# EAGLE design M302X (EAGLE 6.6.0)
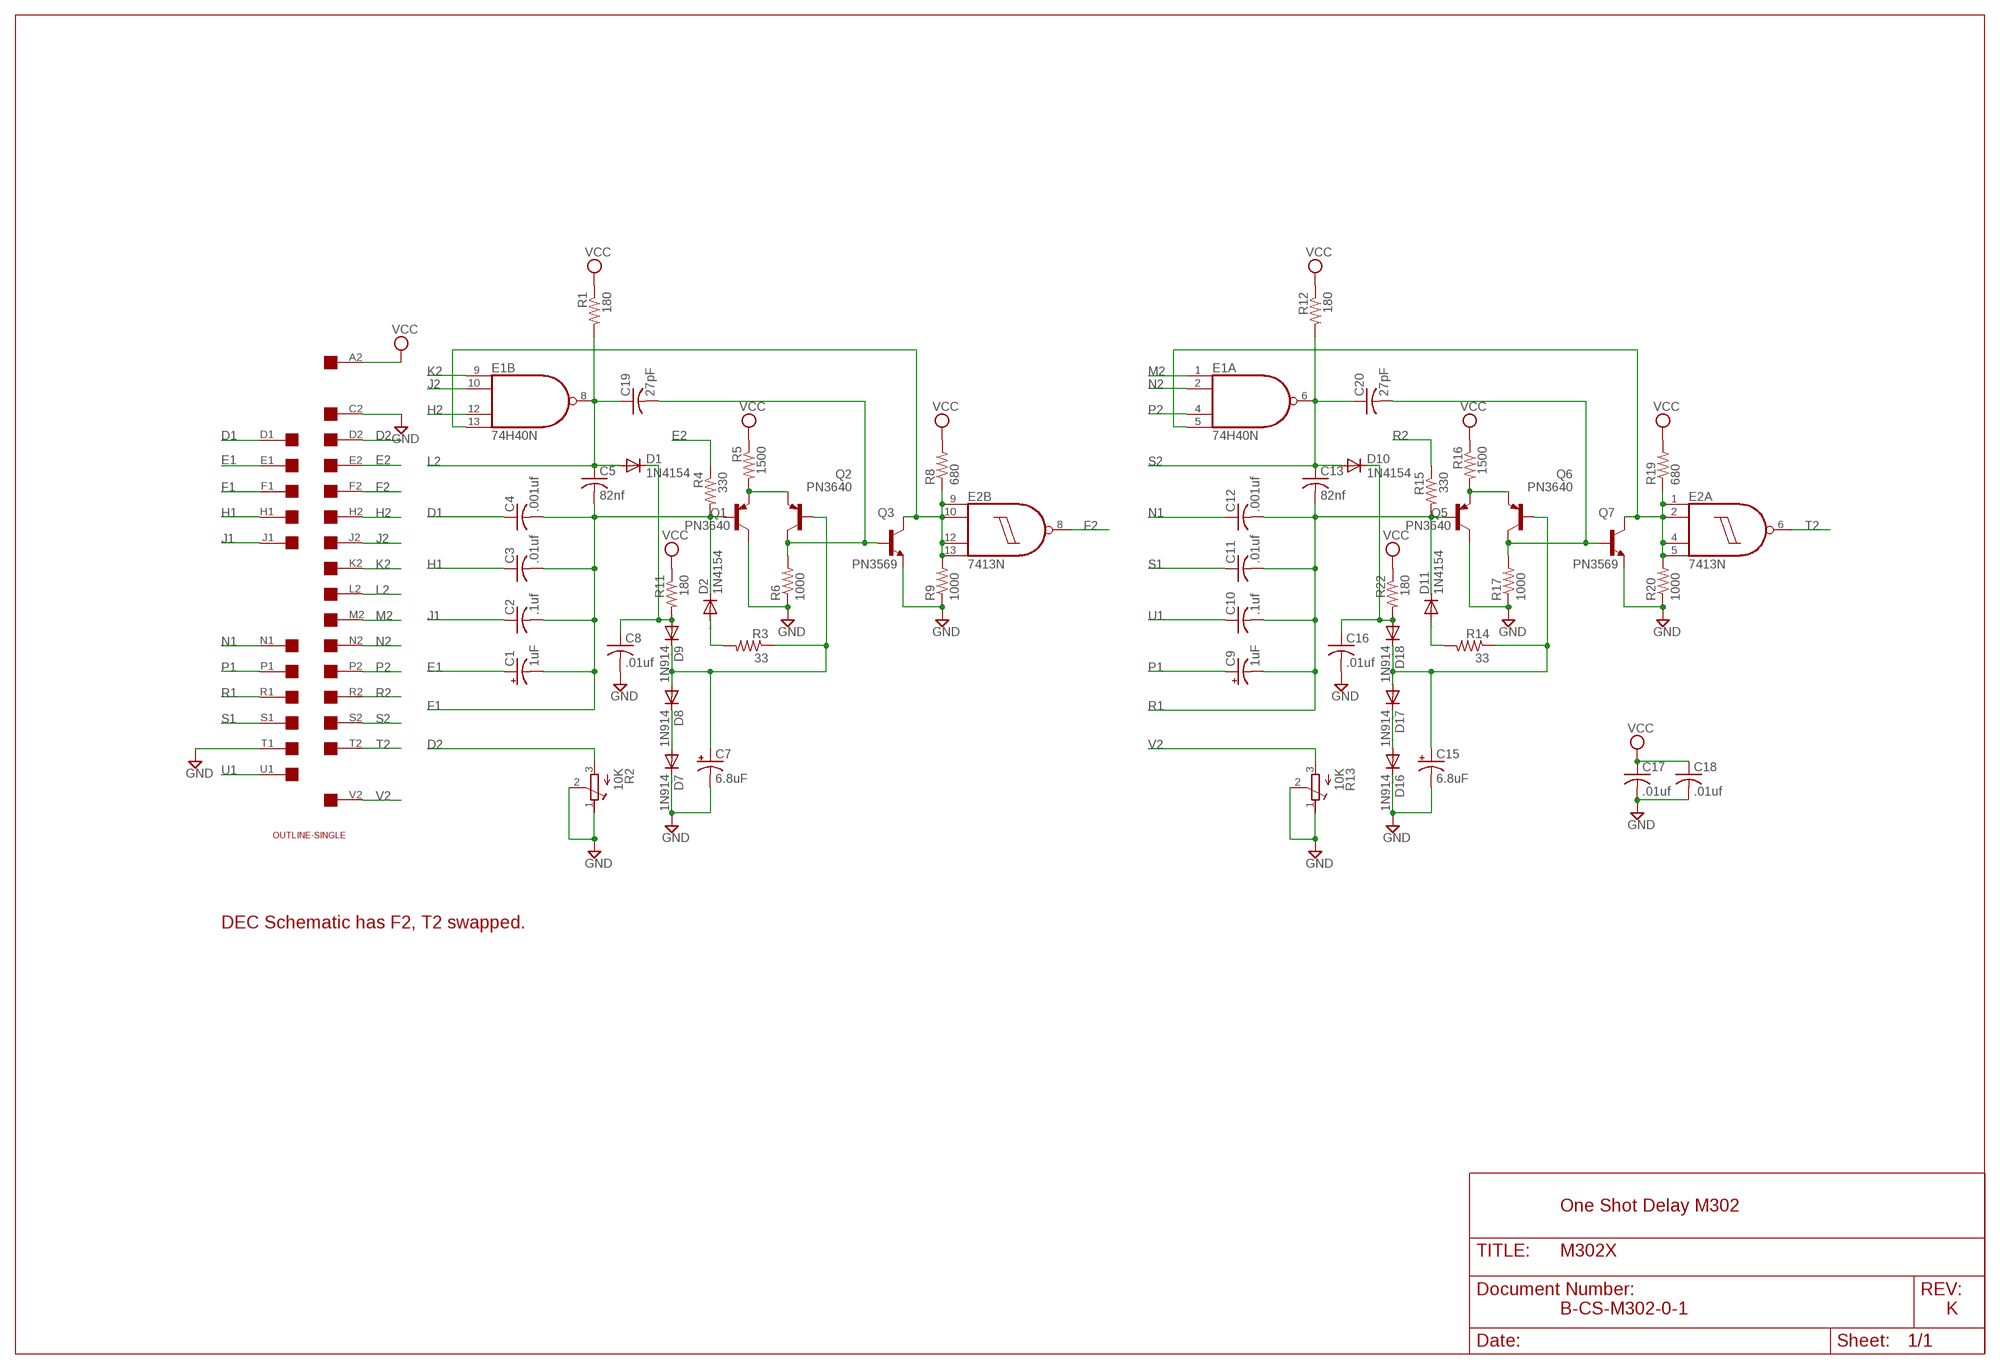
[diagram p0: schematic, sheet 1]

## Parts
C1  1uF  CPOL-USE15-5AXIAL  [E15-5]
C2  .1uf  C-US275-093X316  [C275-093X316]
C3  .01uf  C-US225-062X268  [C225-062X268]
C4  .001uf  C-US075-032X103  [C075-032X103]
C5  82nf  C-US075-032X103  [C075-032X103]
C7  6.8uF  CPOL-USE20-8AXIAL  [E12-8]
C8  .01uf  C-US050-025X075  [C050-025X075]
C9  1uF  CPOL-USE15-5AXIAL  [E15-5]
C10  .1uf  C-US275-093X316  [C275-093X316]
C11  .01uf  C-US225-062X268  [C225-062X268]
C12  .001uf  C-US075-032X103  [C075-032X103]
C13  82nf  C-US075-032X103  [C075-032X103]
C15  6.8uF  CPOL-USE20-8AXIAL  [E12-8]
C16  .01uf  C-US050-025X075  [C050-025X075]
C17  .01uf  C-US050-025X075  [C050-025X075]
C18  .01uf  C-US050-025X075  [C050-025X075]
C19  27pF  C-US075-032X103  [C075-032X103]
C20  27pF  C-US050-025X075  [C050-025X075]
D1  1N4154  1N4148DO35-10  [DO35-10]
D2  1N4154  1N4148DO35-10  [DO35-10]
D7  1N914  1N4148DO35-10  [DO35-10]
D8  1N914  1N4148DO35-10  [DO35-10]
D9  1N914  1N4148DO35-10  [DO35-10]
D10  1N4154  1N4148DO35-10  [DO35-10]
D11  1N4154  1N4148DO35-10  [DO35-10]
D16  1N914  1N4148DO35-10  [DO35-10]
D17  1N914  1N4148DO35-10  [DO35-10]
D18  1N914  1N4148DO35-10  [DO35-10]
E1  74H40N  74S20N  [DIL14]
E2  7413N  [DIL14]
Q1  PN3640  2N3637-PNP-TO39-EBC  [TO39]
Q2  PN3640  2N3637-PNP-TO39-EBC  [TO39]
Q3  PN3569  2N3019-NPN-TO39-EBC  [TO39]
Q5  PN3640  2N3637-PNP-TO39-EBC  [TO39]
Q6  PN3640  2N3637-PNP-TO39-EBC  [TO39]
Q7  PN3569  2N3019-NPN-TO39-EBC  [TO39]
R1  180  R-US_0207/10  [0207/10]
R2  10K  275P  [3006Y]
R3  33  R-US_0207/10  [0207/10]
R4  330  R-US_0207/10  [0207/10]
R5  1500  R-US_0207/10  [0207/10]
R6  1000  R-US_0207/10  [0207/10]
R8  680  R-US_0207/10  [0207/10]
R9  1000  R-US_0207/10  [0207/10]
R11  180  R-US_0207/10  [0207/10]
R12  180  R-US_0207/10  [0207/10]
R13  10K  275P  [3006Y]
R14  33  R-US_0207/10  [0207/10]
R15  330  R-US_0207/10  [0207/10]
R16  1500  R-US_0207/10  [0207/10]
R17  1000  R-US_0207/10  [0207/10]
R19  680  R-US_0207/10  [0207/10]
R20  1000  R-US_0207/10  [0207/10]
R22  180  R-US_0207/10  [0207/10]
U$1  SINGLE  [EDGE-CON2]
U$2  OUTLINE-SINGLE  [SINGLE]

## Nets
D1: C4.1 U$1.D1
D2: R2.3(E) U$1.D2
E1: C1.+ U$1.E1
E2: R4.1 U$1.E2
F1: C1.- C2.2 C3.2 C4.2 C5.2 D2.C Q1.2(B) R4.2 U$1.F1
F2: E2.8(B:O) U$1.F2
GND [power]: C7.- C8.2 C15.- C16.2 C17.2 C18.2 D7.C D16.C Q1.3(C) Q3.1(E) Q5.3(C) Q7.1(E) R2.1(A) R2.2(S) R6.1 R9.1 R13.1(A) R13.2(S) R17.1 R20.1 U$1.C2 U$1.T1
H1: C3.1 U$1.H1
H2: E1.12(B:I2) U$1.H2
J1: C2.1 U$1.J1
J2: E1.10(B:I1) U$1.J2
K2: E1.9(B:I0) U$1.K2
L2: C5.1 C19.1 D1.A E1.8(B:O) R1.2 U$1.L2
M2: E1.1(A:I0) U$1.M2
N1: C12.1 U$1.N1
N2: E1.2(A:I1) U$1.N2
N$1: C8.1 D1.C D9.A R11.2
N$2: E1.13(B:I3) E2.9(B:I0) E2.10(B:I1) E2.12(B:I2) E2.13(B:I3) Q3.3(C) R8.1 R9.2
N$3: Q1.1(E) Q2.1(E) R5.2
N$4: E1.5(A:I3) E2.1(A:I0) E2.2(A:I1) E2.4(A:I2) E2.5(A:I3) Q7.3(C) R19.1 R20.2
N$5 [power]: C7.+ D8.A D9.C Q2.2(B) R3.1
N$6: C20.2 Q6.3(C) Q7.2(B) R17.2
N$7: D2.A R3.2
N$8: C19.2 Q2.3(C) Q3.2(B) R6.2
N$9: D7.A D8.C
N$10: Q5.1(E) Q6.1(E) R16.2
N$12: C15.+ D17.A D18.C Q6.2(B) R14.1
N$13: D11.A R14.2
N$16: C16.1 D10.C D18.A R22.2
N$20: D16.A D17.C
P1: C9.+ U$1.P1
P2: E1.4(A:I2) U$1.P2
R1: C9.- C10.2 C11.2 C12.2 C13.2 D11.C Q5.2(B) R15.2 U$1.R1
R2: R15.1 U$1.R2
S1: C11.1 U$1.S1
S2: C13.1 C20.1 D10.A E1.6(A:O) R12.2 U$1.S2
T2: E2.6(A:O) U$1.T2
U1: C10.1 U$1.U1
V2: R13.3(E) U$1.V2
VCC [power]: C17.1 C18.1 R1.1 R5.1 R8.2 R11.1 R12.1 R16.1 R19.2 R22.1 U$1.A2
Unconnected: U$1.A1 U$1.B1 U$1.B2 U$1.C1 U$1.K1 U$1.L1 U$1.M1 U$1.U2 U$1.V1

## Notes on the sheet
- DEC Schematic has F2, T2 swapped.
- One Shot Delay M302
- B-CS-M302-0-1 | K

## Power pins joined to a net without a drawn wire
GND: E1.7(P:GND) E2.7(P:GND)
VCC: E1.14(P:VCC) E2.14(P:VCC)

## Library data of the parts
C1 C9 = rcl:CPOL-US: POLARIZED CAPACITOR, American symbol
C2-C5 C8 C10-C13 C16-C20 = rcl:C-US: CAPACITOR, American symbol
C7 C15 = dec-con:CPOL-USE20-8AXIAL: A 0.8 inch electrolytic.
D1 D2 D7-D11 D16-D18 = diode:1N4148: DIODE high speed (Philips)
E1 = 74xx-us:74*20: Dual 4-input NAND gate
E2 = 74xx-us:74*13: Dual 4-input NAND schmitt trigger
Q1 Q2 Q5 Q6 = transistor:*-PNP-: PNP Transistror
Q3 Q7 = transistor:*-NPN-: NPN Transistror BF959 corrected 2008.03.06
R1 R3-R6 R8 R9 R11 R12 R14-R17 R19 R20 R22 = rcl:R-US_: RESISTOR, American symbol
R2 R13 = dec-con:275P: Trimpot with 275P (3006Y) footprint.
U$1 = dec-con:SINGLE: Single-Height DEC board
U$2 = dec-con:OUTLINE-*: Board outlines for DEC boards.

## Net classes
1 power: width 0.813 mm, clearance 0.508 mm

## Board
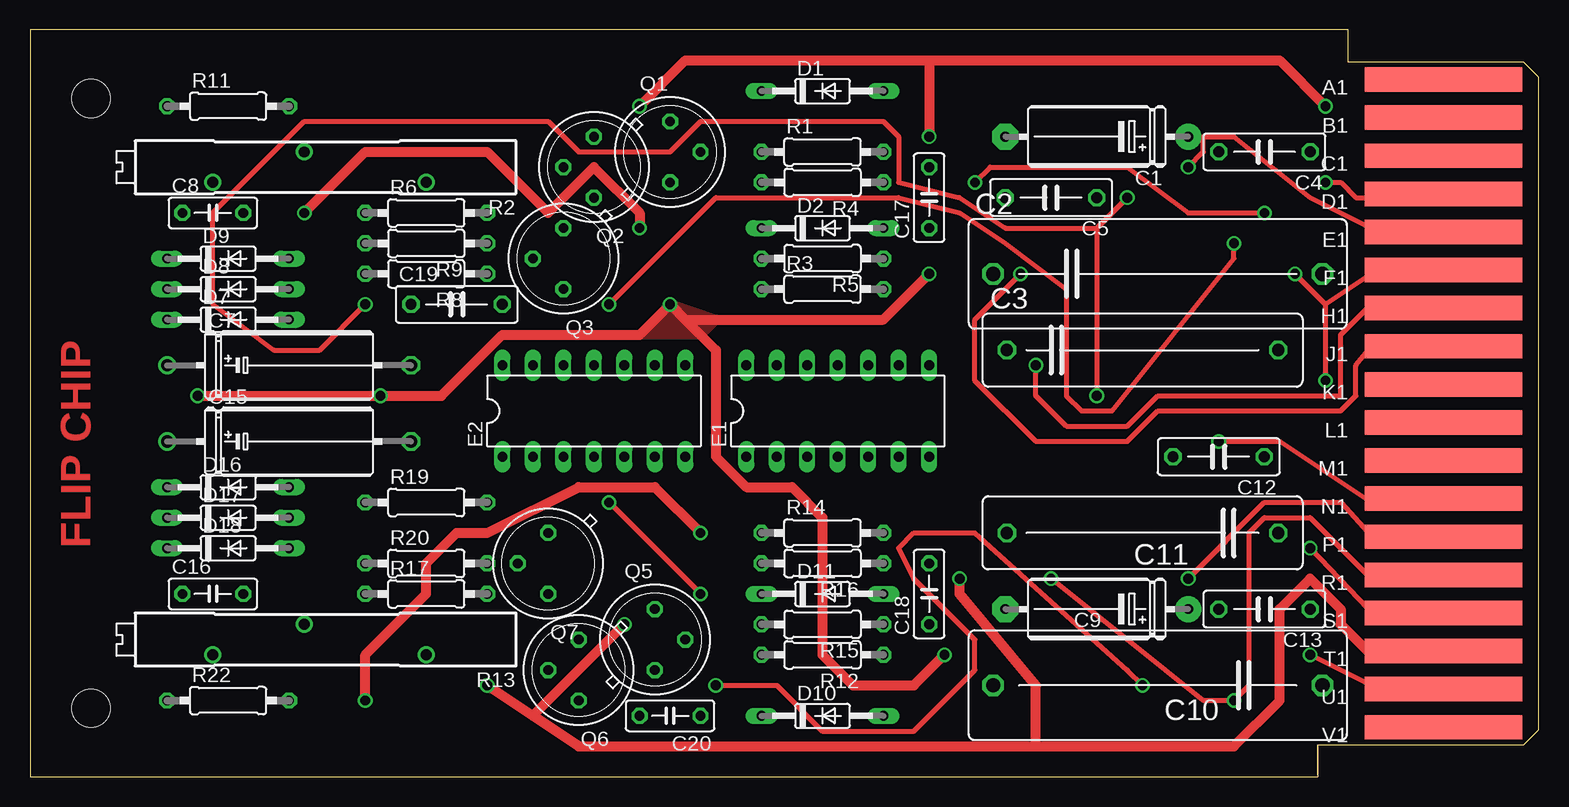
[diagram p1: board, top side]
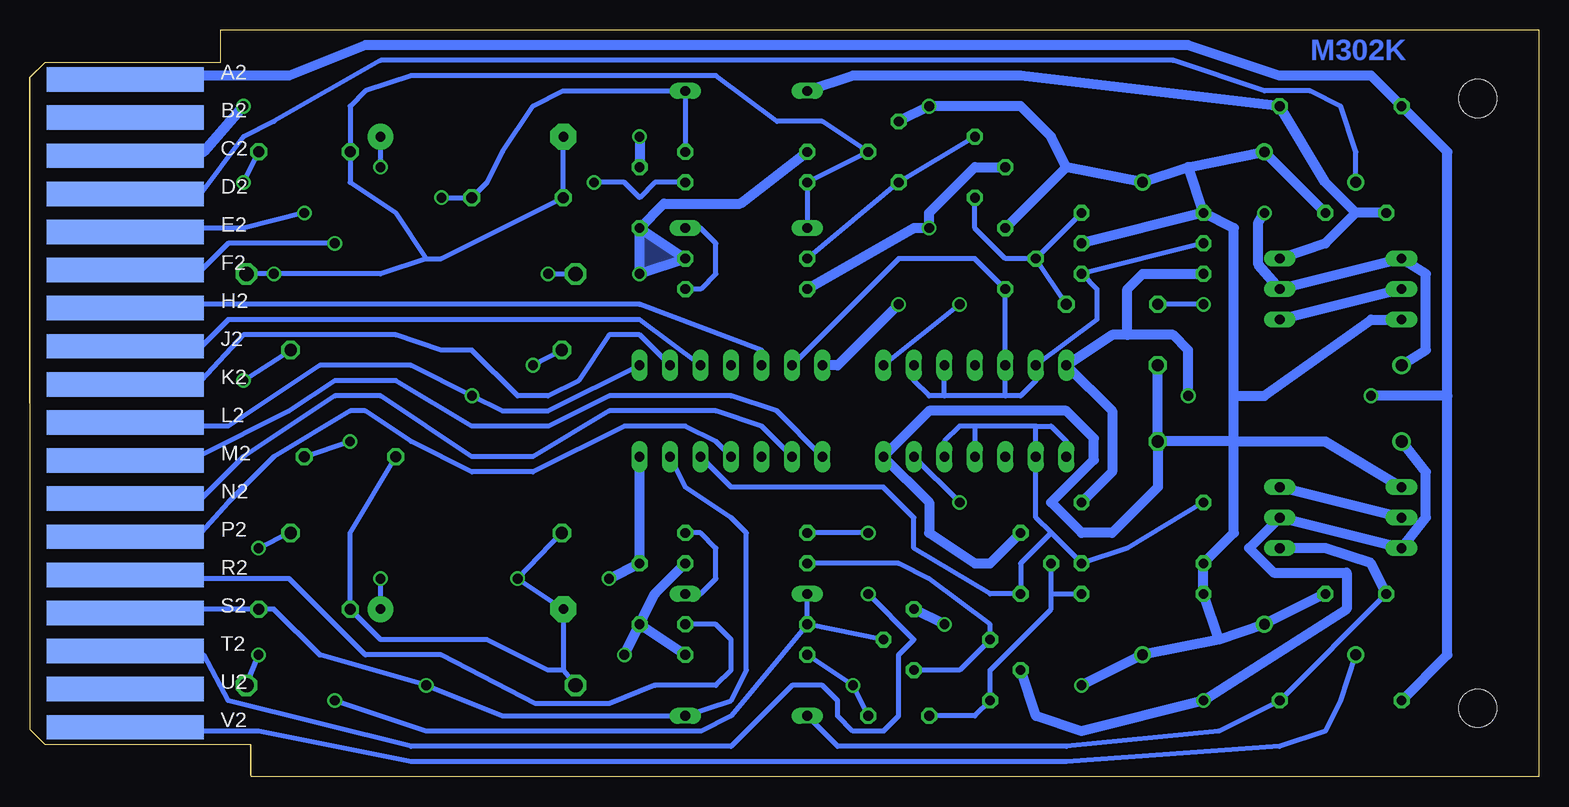
[diagram p2: board, bottom side, seen from below]

Size 125.73 x 62.23 mm. Coordinates in mm from the lower left corner, seen from the top.
Copper layers (1+16): Top 0.035mm / dielectric 1.5mm / Bottom 0.035mm
Design rules "16mils": minimum track width 16mil, minimum drill 32mil, track to track 15mil, track to pad 10mil, pad to pad 10mil, via to via 10mil, smd to smd 10mil, copper to edge 13mil, drill to drill 10mil, minimum pad ring 10mil, minimum via ring 8mil, stop-mask expansion 0mil, vias tented up to drill 0mil, thermal gap 10mil

### Footprints (pad centres in the part's own frame; a part is rotated, then mirrored left to right if it is on the bottom)
E15-5 = drill 0.813 pad 2.159: + -7.62,0 | drill 0.813 pad 2.159 octagon: - 7.62,0
C275-093X316 = drill 1.194 octagon: 1 -13.716,0; 2 13.716,0
C225-062X268 = drill 1.016 octagon: 1 -11.303,0; 2 11.303,0
C075-032X103 = drill 0.914 octagon: 1 -3.81,0; 2 3.81,0
E12-8 = drill 1.016: + -10.16,0 | drill 1.016 octagon: - 10.16,0
C050-025X075 = drill 0.813 octagon: 1 -2.54,0; 2 2.54,0
DO35-10 = drill 0.813 long: A 5.08,0; C -5.08,0
DIL14 = drill 0.813 long: 1 -7.62,-3.81; 2 -5.08,-3.81; 3 -2.54,-3.81; 4 0,-3.81; 5 2.54,-3.81; 6 5.08,-3.81; 7 7.62,-3.81; 8 7.62,3.81; 9 5.08,3.81; 10 2.54,3.81; 11 0,3.81; 12 -2.54,3.81; 13 -5.08,3.81; 14 -7.62,3.81
TO39 = drill 0.813 octagon: 1 0,-2.54; 2 2.54,0; 3 0,2.54
0207/10 = drill 0.813 octagon: 1 -5.08,0; 2 5.08,0
3006Y = drill 0.9: 1 -8.89,1.27; 2 1.27,-1.27; 3 8.89,1.27
EDGE-CON2 = smd 13.106 x 2.032: A1 7.938,4.128; B1 7.938,7.303; C1 7.938,10.477; D1 7.938,13.652; E1 7.938,16.828; F1 7.938,20.003; H1 7.938,23.177; J1 7.938,26.352; K1 7.938,29.527; L1 7.938,32.703; M1 7.938,35.877; N1 7.938,39.053; P1 7.938,42.227; R1 7.938,45.403; S1 7.938,48.578; T1 7.938,51.752; U1 7.938,54.928; V1 7.938,58.102 | smd 13.106 x 2.032 bottom: A2 7.938,4.128; B2 7.938,7.303; C2 7.938,10.477; D2 7.938,13.652; E2 7.938,16.828; F2 7.938,20.003; H2 7.938,23.177; J2 7.938,26.352; K2 7.938,29.527; L2 7.938,32.703; M2 7.938,35.877; N2 7.938,39.053; P2 7.938,42.227; R2 7.938,45.403; S2 7.938,48.578; T2 7.938,51.752; U2 7.938,54.928; V2 7.938,58.102
SINGLE = hole 3.175: 120.65,56.515; 120.65,5.715

### Placement (x,y rotation side)
C1  88.9,53.34 180 top
C2  93.98,41.91 0 top
C3  92.71,35.56 0 top
C4  102.87,52.07 180 top
C5  85.09,48.26 180 top
C7  21.59,34.29 0 top
C8  15.24,46.99 0 top
C9  88.9,13.97 180 top
C10  93.98,7.62 180 top
C11  92.71,20.32 180 top
C12  99.06,26.67 180 top
C13  102.87,13.97 180 top
C15  21.59,27.94 0 top
C16  15.24,15.24 0 top
C17  74.93,48.26 90 top
C18  74.93,15.24 90 top
C19  35.56,39.37 0 top
C20  53.34,5.08 180 top
D1  66.04,57.15 0 top
D2  66.04,45.72 0 top
D7  16.51,38.1 0 top
D8  16.51,40.64 0 top
D9  16.51,43.18 0 top
D10  66.04,5.08 0 top
D11  66.04,15.24 0 top
D16  16.51,24.13 0 top
D17  16.51,21.59 0 top
D18  16.51,19.05 0 top
E1  67.31,30.48 0 top
E2  46.99,30.48 0 top
Q1  53.34,52.07 0 top
Q2  46.99,50.8 180 top
Q3  44.45,43.18 180 top
Q5  52.07,11.43 0 top
Q6  45.72,8.89 180 top
Q7  43.18,17.78 180 top
R1  66.04,52.07 0 top
R2  24.13,50.8 180 top
R3  66.04,40.64 0 top
R4  66.04,49.53 180 top
R5  66.04,43.18 180 top
R6  33.02,46.99 0 top
R8  33.02,41.91 180 top
R9  33.02,44.45 180 top
R11  16.51,55.88 0 top
R12  66.04,10.16 180 top
R13  24.13,11.43 180 top
R14  66.04,20.32 0 top
R15  66.04,12.7 180 top
R16  66.04,17.78 180 top
R17  33.02,15.24 0 top
R19  33.02,22.86 0 top
R20  33.02,17.78 0 top
R22  16.51,6.35 0 top
U$1  125.73,62.23 180 top
U$2  125.73,62.23 180 top
U$3  [FLIPCHIP]  0,0 0 top

### Tracks (layer width: path | path; a pad name or v marks a point on that pad's centre or on a via)
D1  (via drill 0.81)
  Top 0.406: U$1.D1 116.84,48.26 110.49,48.26 109.22,49.53 v107.95,49.53
  Bottom 0.406: v107.95,49.53 C4.1
D2
  Bottom 0.406: U$1.D2 116.84,48.26 111.76,48.26 107.95,53.34 105.41,54.61 96.52,59.69 30.48,59.69 22.86,57.15 19.05,57.15 16.51,55.88 15.24,52.07 R2.3
E1  (via drill 0.81)
  Top 0.406: U$1.E1 116.84,45.72 111.76,45.72 106.68,48.26 100.33,53.34 97.79,53.34 97.79,52.07 v96.52,50.8
  Bottom 0.406: v96.52,50.8 C1.+
E2  (via drill 0.81)
  Top 0.406: v78.74,49.53 80.01,50.8 91.44,50.8 96.52,46.99 v102.87,46.99
  Bottom 0.406: U$1.E2 116.84,45.72 107.95,45.72 v102.87,46.99 | R4.1 73.66,49.53 74.93,48.26 76.2,49.53 v78.74,49.53
F1  (via drill 0.81)
  Top 0.406: U$1.F1 116.84,41.91 111.76,41.91 107.95,39.37 | v105.41,41.91 107.95,39.37 | 107.95,39.37 v107.95,33.02
  Bottom 0.406: C1.- C5.2 91.44,43.18 92.71,43.18 | 92.71,43.18 95.25,46.99 99.06,49.53 C4.2 99.06,55.88 97.79,57.15 93.98,58.42 68.58,58.42 63.5,54.61 59.69,54.61 Q1.2 R4.2 D2.C | 92.71,43.18 96.52,41.91 v105.41,41.91 C2.2 | v107.95,33.02 C3.2
F2  (via drill 0.81)
  Top 0.406: v48.26,39.37 57.15,48.26 72.39,48.26 77.47,46.99 81.28,44.45 86.36,40.64 86.36,31.75 87.63,30.48 90.17,30.48 100.33,43.18 v100.33,44.45
  Bottom 0.406: U$1.F2 116.84,41.91 111.76,41.91 109.22,44.45 v100.33,44.45 | E2.8 v48.26,39.37
GND  (via drill 0.81)
  Top 0.813: v107.95,55.88 104.14,59.69 74.93,59.69 | 74.93,59.69 54.61,59.69 v50.8,55.88 | U$1.T1 116.84,10.16 111.76,10.16 109.22,12.7 109.22,13.97 106.68,16.51 104.14,13.97 104.14,6.35 100.33,2.54 83.82,2.54 | 83.82,2.54 45.72,2.54 41.91,5.08 | v38.1,7.62 41.91,5.08 | v77.47,16.51 77.47,15.24 83.82,7.62 83.82,2.54 | 41.91,5.08 v49.53,12.7 | 74.93,59.69 v74.93,53.34
  Bottom 0.813: U$1.C2 116.84,52.07 111.25,52.07 v107.95,55.88 | Q1.3 v50.8,55.88 43.18,55.88 40.64,53.34 39.37,50.8 | v74.93,53.34 C17.2 | E1.7 C18.2 v77.47,16.51 | v38.1,7.62 R13.1 26.67,11.43 | 26.67,11.43 R13.2 C16.2 | 26.67,11.43 R17.1 R20.1 25.4,20.32 25.4,27.94 | 25.4,27.94 25.4,31.75 | 25.4,31.75 25.4,45.72 R6.1 | 25.4,27.94 C15.- | C15.- C7.- | D16.C 17.78,27.94 25.4,27.94 | D7.C 13.97,38.1 22.86,31.75 25.4,31.75 | C8.2 R2.2 29.21,50.8 | 39.37,50.8 Q3.1 | 39.37,50.8 R2.1 29.21,50.8 | R6.1 29.21,50.8 | R6.1 R9.1 | C15.- 31.75,24.13 35.56,20.32 38.1,20.32 40.64,22.86 37.08,26.42 37.08,28.19 39.37,30.48 50.8,30.48 E2.7 50.8,22.86 50.8,20.32 46.99,17.78 45.72,17.78 Q7.1 | v49.53,12.7 Q5.3
H1  (via drill 0.81)
  Top 0.406: v83.82,34.29 83.82,31.75 86.36,29.21 91.44,29.21 93.98,31.75 109.22,31.75 109.22,36.83 111.76,39.37 116.84,39.37 U$1.H1
  Bottom 0.406: v83.82,34.29 C3.1
H2
  Bottom 0.406: E1.12 64.77,35.56 74.93,39.37 116.84,39.37 U$1.H2
J1  (via drill 0.81)
  Top 0.406: v82.55,41.91 78.74,38.1 78.74,33.02 83.82,27.94 91.44,27.94 93.98,30.48 109.22,30.48 110.49,31.75 110.49,34.29 111.51,35.56 116.84,35.56 U$1.J1
  Bottom 0.406: v82.55,41.91 C2.1
J2
  Bottom 0.406: E1.10 74.93,38.1 109.22,38.1 111.76,35.56 116.84,35.56 U$1.J2
K2
  Bottom 0.406: E1.9 74.93,36.83 77.47,36.83 80.01,33.02 82.55,31.75 85.09,31.75 88.9,35.56 91.44,35.56 95.25,36.83 107.95,36.83 111.51,33.02 116.84,33.02 U$1.K2
L2  (via drill 0.81)
  Top 0.406: v27.94,39.37 24.13,35.56 20.32,35.56 15.24,39.37 15.24,46.99 22.86,54.61 43.18,54.61 45.72,52.07 53.34,52.07 55.88,54.61 71.12,54.61 72.39,53.34 72.39,49.53 77.47,48.26 81.28,45.72 88.9,45.72 | 88.9,45.72 v91.44,48.26 | 88.9,45.72 v88.9,31.75
  Bottom 0.406: v91.44,48.26 C5.1 87.63,49.53 86.36,52.07 83.82,55.88 81.28,57.15 D1.A R1.2 | U$1.L2 116.84,29.21 109.22,29.21 101.6,34.29 93.98,34.29 v88.9,31.75 86.36,30.48 82.55,30.48 E1.8 | v27.94,39.37 C19.1
M2
  Bottom 0.406: U$1.M2 116.84,26.67 111.76,26.67 104.14,30.48 100.33,33.02 95.25,33.02 88.9,29.21 82.55,29.21 77.47,31.75 67.31,31.75 63.5,30.48 E1.1
N1  (via drill 0.81)
  Top 0.406: U$1.N1 116.84,22.86 111.76,22.86 104.14,27.94 v99.06,27.94
  Bottom 0.406: C12.1 v99.06,27.94
N2
  Bottom 0.406: E1.2 64.77,29.21 68.58,30.48 77.47,30.48 83.82,26.67 88.9,26.67 96.52,31.75 100.33,31.75 107.95,26.67 111.76,22.86 116.84,22.86 U$1.N2
N$1
  Bottom 0.813: 15.24,46.99 17.78,49.53 R11.2 43.18,58.42 57.15,58.42 D1.C | C8.1 15.24,46.99 | D9.A 17.78,44.45 15.24,46.99
N$2
  Bottom 0.406: R9.2 R8.1 36.83,40.64 36.83,38.1 E2.13 41.91,33.02 43.18,31.75 44.45,31.75 | E1.13 53.34,43.18 46.99,43.18 Q3.3 E2.12 44.45,31.75 | 49.53,31.75 E2.10 | 44.45,31.75 49.53,31.75 | E2.9 52.07,33.02 50.8,31.75 49.53,31.75
N$3
  Bottom 0.406: Q2.1 Q1.1 R5.2
N$4
  Bottom 0.406: E1.5 67.31,24.13 54.61,24.13 52.07,21.59 52.07,19.05 45.72,15.24 Q7.3 43.18,17.78 40.64,20.32 | R19.1 34.29,19.05 R20.2 40.64,20.32 | 40.64,20.32 41.91,21.59 E2.2 41.91,29.21 | 41.91,29.21 40.64,29.21 39.37,27.94 E2.1 | 41.91,29.21 46.99,29.21 | 46.99,29.21 E2.4 | 46.99,29.21 48.26,29.21 49.53,27.94 E2.5
N$5  (via drill 0.81)
  Top 0.813: v22.86,46.99 27.94,52.07 38.1,52.07 43.18,46.99 46.99,50.8 50.8,46.99 v50.8,45.72
  Bottom 0.813: Q2.2 46.99,50.8 50.8,46.99 v50.8,45.72 52.07,45.72 R3.1 | C7.+ 9.4,35.56 9.4,41.91 D9.C D8.A 23.37,42.67 23.37,46.23 v22.86,46.99
N$6
  Bottom 0.406: 40.64,15.24 40.64,13.97 45.72,8.89 Q6.3 46.99,5.08 C20.2 | 40.64,15.24 Q7.2 | 40.64,15.24 R17.2
N$7
  Bottom 0.406: R3.2 69.85,40.64 68.58,41.91 68.58,44.45 69.85,45.72 D2.A
N$8
  Bottom 0.406: Q3.2 R6.2 | C19.2 Q3.2 | Q2.3 46.99,45.72 44.45,43.18 Q3.2
N$9
  Bottom 0.813: D8.C D7.A
N$10
  Bottom 0.406: Q5.1 48.26,8.89 Q6.1 45.72,12.7 50.8,16.51 53.34,17.78 R16.2
N$12  (via drill 0.81)
  Top 0.813: v27.94,6.35 27.94,10.16 33.02,15.24 33.02,17.78 35.56,20.32 38.1,20.32 45.72,24.13 52.07,24.13 v55.88,20.32
  Bottom 0.406: v55.88,20.32 R14.1
  Bottom 0.813: Q6.2 41.91,5.08 38.1,3.81 v27.94,6.35 16,13.97 16,17.02 22.1,17.02 24.13,19.05 D17.A D18.C 9.4,21.59 9.4,25.4 C15.+
N$13
  Bottom 0.406: D11.A 69.85,15.24 68.58,16.51 68.58,19.05 69.85,20.32 R14.2
N$16
  Bottom 0.406: D10.C 58.42,2.54 39.37,2.54 26.67,3.81 R22.2 C16.1
  Bottom 0.813: D18.A 17.78,19.05 13.97,17.78 C16.1
N$20
  Bottom 0.813: D17.C D16.A
P1  (via drill 0.81)
  Top 0.406: U$1.P1 116.84,20.32 111.51,20.32 109.22,22.86 102.87,22.86 v96.52,16.51
  Bottom 0.406: C9.+ v96.52,16.51
P2
  Bottom 0.406: U$1.P2 116.84,20.32 111.51,20.32 109.22,22.86 105.41,26.67 99.06,30.48 97.79,30.48 93.98,27.94 88.9,25.4 83.82,25.4 76.2,29.21 71.12,29.21 68.58,27.94 E1.4
R1  (via drill 0.81)
  Top 0.406: U$1.R1 116.84,16.51 111.76,16.51 106.68,21.59 102.87,21.59 101.6,20.32 101.6,7.62 v100.33,6.35 97.79,6.35 v85.09,16.51
  Bottom 0.406: 81.28,8.89 C10.2 | 81.28,8.89 C9.- v85.09,16.51 C11.2 | 81.28,8.89 82.55,8.89 87.63,11.43 96.52,11.43 C13.2 99.06,20.32 C12.2 | Q5.2 R15.2 | R15.2 D11.C | R15.2 67.31,5.08 69.85,3.81 92.71,3.81 v100.33,6.35
R2
  Bottom 0.406: U$1.R2 116.84,16.51 104.14,16.51 97.79,10.16 91.44,10.16 83.57,6.1 77.47,6.1 73.66,7.62 68.58,7.62 67.31,8.89 67.31,11.43 68.58,12.7 R15.1
S1  (via drill 0.81)
  Top 0.406: U$1.S1 116.84,13.97 111.51,13.97 v106.68,19.05
  Bottom 0.406: C11.1 104.14,20.32 v106.68,19.05
S2  (via drill 0.81)
  Top 0.406: v57.15,7.62 62.23,7.62 66.04,3.81 73.66,3.81 78.74,8.89 78.74,11.43 73.66,16.51 72.39,19.05 73.66,20.32 78.74,20.32 91.44,8.89 v92.71,7.62
  Bottom 0.406: U$1.S2 116.84,13.97 C13.1 105.41,13.97 101.6,10.16 v92.71,7.62 86.36,5.08 D10.A 67.31,6.35 66.04,8.89 66.04,20.32 67.31,21.59 71.12,24.13 E1.6 | R12.2 v57.15,7.62 C20.1
T2  (via drill 0.81)
  Top 0.406: v55.88,15.24 v48.26,22.86
  Bottom 0.406: U$1.T2 116.84,10.16 111.25,10.16 109.22,6.35 93.98,2.54 67.31,2.54 62.23,7.62 59.69,7.62 58.42,6.35 58.42,5.08 57.15,3.81 54.61,3.81 53.34,5.08 53.34,10.16 52.07,11.43 v55.88,15.24 | v48.26,22.86 E2.6
U1  (via drill 0.81)
  Top 0.406: U$1.U1 116.84,7.62 111.76,7.62 v106.68,10.16
  Bottom 0.406: C10.1 v106.68,10.16
V2
  Bottom 0.406: U$1.V2 116.84,3.81 106.68,3.81 93.98,1.27 39.37,1.27 21.59,2.54 17.78,3.81 16.51,6.35 R13.3
VCC  (via drill 0.81)
  Top 0.813: v76.2,10.16 73.66,7.62 68.58,7.62 66.04,10.16 66.04,21.59 63.5,24.13 59.69,24.13 57.15,26.67 57.15,35.56 54.61,38.1 | 54.61,38.1 v53.34,39.37 50.8,36.83 39.37,36.83 34.29,31.75 v29.21,31.75 v13.97,31.75 | 54.61,38.1 71.12,38.1 v74.93,41.91
  Bottom 0.813: U$1.A2 117.24,58.02 116.84,58.42 104.14,58.42 97.79,60.96 29.21,60.96 21.59,58.42 13.97,58.42 R11.1 7.62,52.07 7.62,31.75 | C17.1 v74.93,41.91 R5.1 C17.1 | C18.1 73.66,15.24 R16.1 | C18.1 R12.1 | v76.2,10.16 C18.1 | 34.29,36.83 30.48,36.83 29.21,35.56 v29.21,31.75 | 34.29,36.83 35.56,36.83 E2.14 35.56,30.48 35.56,25.4 R19.2 | R8.2 33.02,41.91 34.29,40.64 34.29,36.83 | E1.14 58.42,34.29 v53.34,39.37 | R1.1 66.55,47.75 72.9,47.75 C17.1 | R22.1 7.62,10.16 7.62,31.75 | 7.62,31.75 v13.97,31.75
  pour Bottom: 71.12,43.18 74.93,45.72 74.93,41.91
  pour Top: 50.8,36.83 53.34,39.37 57.15,38.1 55.88,36.83

### Text on the board
Bottom: M302K